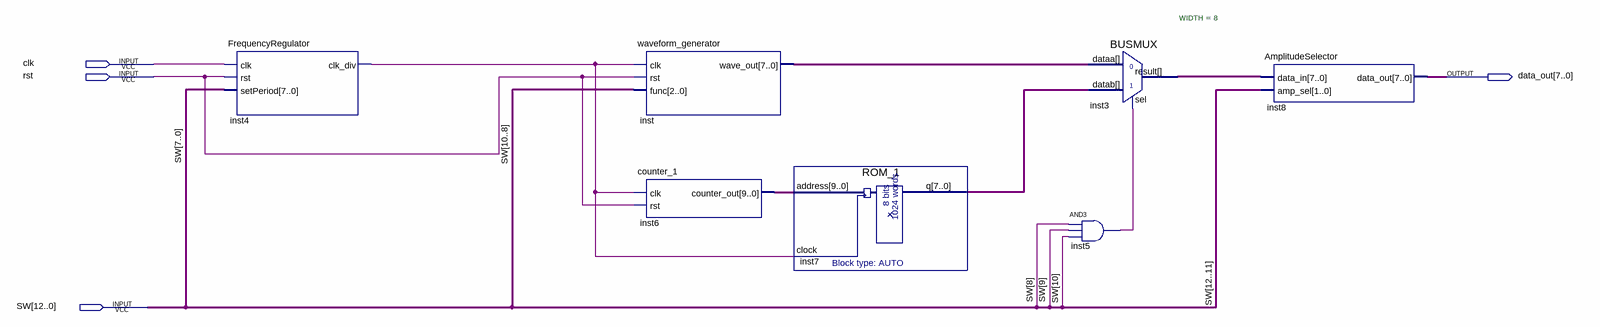
[diagram p0: schematic sheet]
// Quartus schematic WaveformGenerator.bdf as structural Verilog: 7 symbols, 4 pins
module WaveformGenerator (
  input  clk,
  input  rst,
  input  [12:0] SW,
  output [7:0] data_out
);

  wire inst4_clk_div, inst5_out;
  wire [7:0] inst3_result, inst7_q, inst_wave_out;
  wire [9:0] inst6_counter_out;

  FrequencyRegulator inst4 (.clk(clk), .rst(rst), .setPeriod(SW[7:0]), .clk_div(inst4_clk_div));
  waveform_generator inst (.clk(inst4_clk_div), .rst(rst), .func(SW[10:8]), .wave_out(inst_wave_out));
  counter_1 inst6 (.clk(inst4_clk_div), .rst(rst), .counter_out(inst6_counter_out));
  ROM_1 inst7 (.address(inst6_counter_out), .clock(inst4_clk_div), .q(inst7_q));
  and inst5 (inst5_out, SW[8], SW[9], SW[10]);
  BUSMUX #(.WIDTH(8)) inst3 (.datab(inst7_q), .sel(inst5_out), .dataa(inst_wave_out), .result(inst3_result));
  AmplitudeSelector inst8 (.data_in(inst3_result), .amp_sel(SW[12:11]), .data_out(data_out));
endmodule
